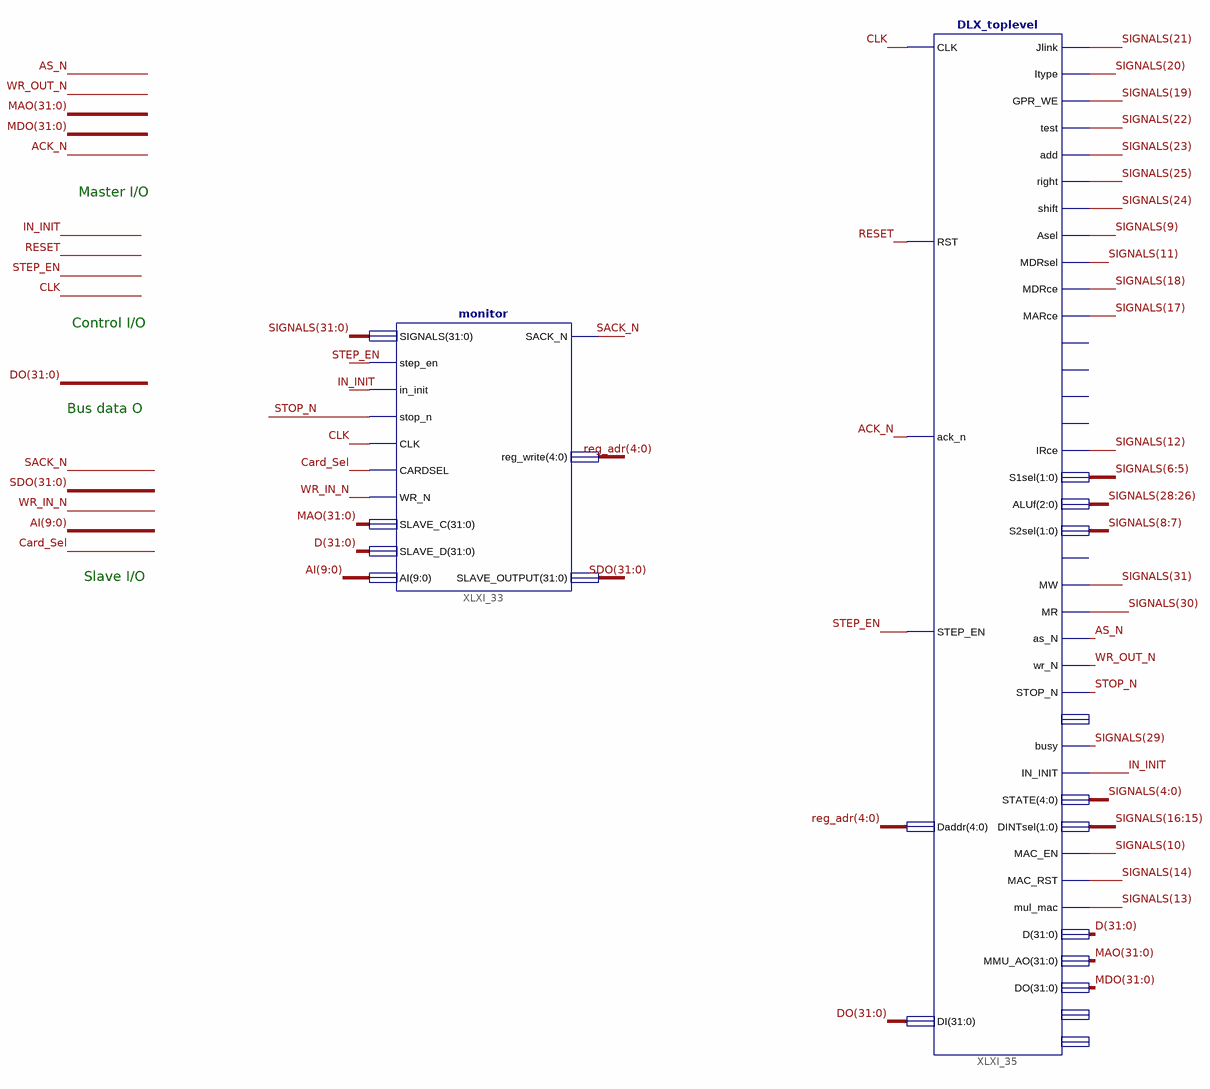
[diagram p0: schematic sheet 1]
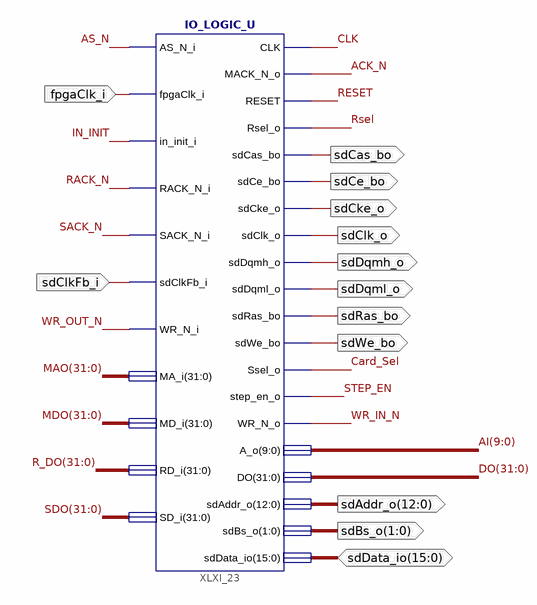
[diagram p1: schematic sheet 2]
// Xilinx ISE schematic Top_Level.sch (spartan6) as structural Verilog: 3 symbols, 13 ports
module Top_Level (
  input  fpgaClk_i,
  input  sdClkFb_i,
  inout  [15:0] sdData_io,
  output sdClk_o,
  output [1:0] sdBs_o,
  output sdDqml_o,
  output sdDqmh_o,
  output sdWe_bo,
  output sdCas_bo,
  output sdRas_bo,
  output sdCe_bo,
  output sdCke_o,
  output [12:0] sdAddr_o
);

  wire ACK_N, AS_N, Card_Sel, CLK, IN_INIT, RACK_N, RESET, Rsel, SACK_N, STEP_EN, STOP_N, WR_IN_N, WR_OUT_N;
  wire [4:0] reg_adr;
  wire [9:0] AI;
  wire [31:0] D, DO, MAO, MDO, R_DO, SDO, SIGNALS;

  IO_LOGIC_U XLXI_23 (
    .AS_N_i(AS_N), .fpgaClk_i(fpgaClk_i), .in_init_i(IN_INIT), .RACK_N_i(RACK_N), .SACK_N_i(SACK_N),
    .sdClkFb_i(sdClkFb_i), .WR_N_i(WR_OUT_N), .MA_i(MAO), .MD_i(MDO), .RD_i(R_DO), .SD_i(SDO), .CLK(CLK),
    .MACK_N_o(ACK_N), .RESET(RESET), .Rsel_o(Rsel), .sdCas_bo(sdCas_bo), .sdCe_bo(sdCe_bo),
    .sdCke_o(sdCke_o), .sdClk_o(sdClk_o), .sdDqmh_o(sdDqmh_o), .sdDqml_o(sdDqml_o), .sdRas_bo(sdRas_bo),
    .sdWe_bo(sdWe_bo), .Ssel_o(Card_Sel), .step_en_o(STEP_EN), .WR_N_o(WR_IN_N), .A_o(AI), .DO(DO),
    .sdAddr_o(sdAddr_o), .sdBs_o(sdBs_o), .sdData_io(sdData_io));
  monitor XLXI_33 (
    .SIGNALS(SIGNALS), .step_en(STEP_EN), .in_init(IN_INIT), .stop_n(STOP_N), .CLK(CLK), .CARDSEL(Card_Sel),
    .WR_N(WR_IN_N), .SLAVE_C(MAO), .SLAVE_D(D), .AI(AI), .SACK_N(SACK_N), .reg_write(reg_adr),
    .SLAVE_OUTPUT(SDO));
  DLX_toplevel XLXI_35 (
    .CLK(CLK), .RST(RESET), .ack_n(ACK_N), .STEP_EN(STEP_EN), .Daddr(reg_adr), .DI(DO), .Jlink(SIGNALS[21]),
    .Itype(SIGNALS[20]), .GPR_WE(SIGNALS[19]), .test(SIGNALS[22]), .add(SIGNALS[23]), .right(SIGNALS[25]),
    .shift(SIGNALS[24]), .Asel(SIGNALS[9]), .MDRsel(SIGNALS[11]), .MDRce(SIGNALS[18]), .MARce(SIGNALS[17]),
    .IRce(SIGNALS[12]), .S1sel(SIGNALS[6:5]), .ALUf(SIGNALS[28:26]), .S2sel(SIGNALS[8:7]), .MW(SIGNALS[31]),
    .MR(SIGNALS[30]), .as_N(AS_N), .wr_N(WR_OUT_N), .STOP_N(STOP_N), .busy(SIGNALS[29]), .IN_INIT(IN_INIT),
    .STATE(SIGNALS[4:0]), .DINTsel(SIGNALS[16:15]), .MAC_EN(SIGNALS[10]), .MAC_RST(SIGNALS[14]),
    .mul_mac(SIGNALS[13]), .D(D), .MMU_AO(MAO), .DO(MDO));  // open: Cce, Bce, Ace, PCce, AEQZ, MAC_State, IR_OUT, PC

  // Notes on the sheet:
  //   Master I/O
  //   Control I/O
  //   Bus data O
  //   Slave I/O
endmodule
